# Altium project Current-Probe.PrjPcb
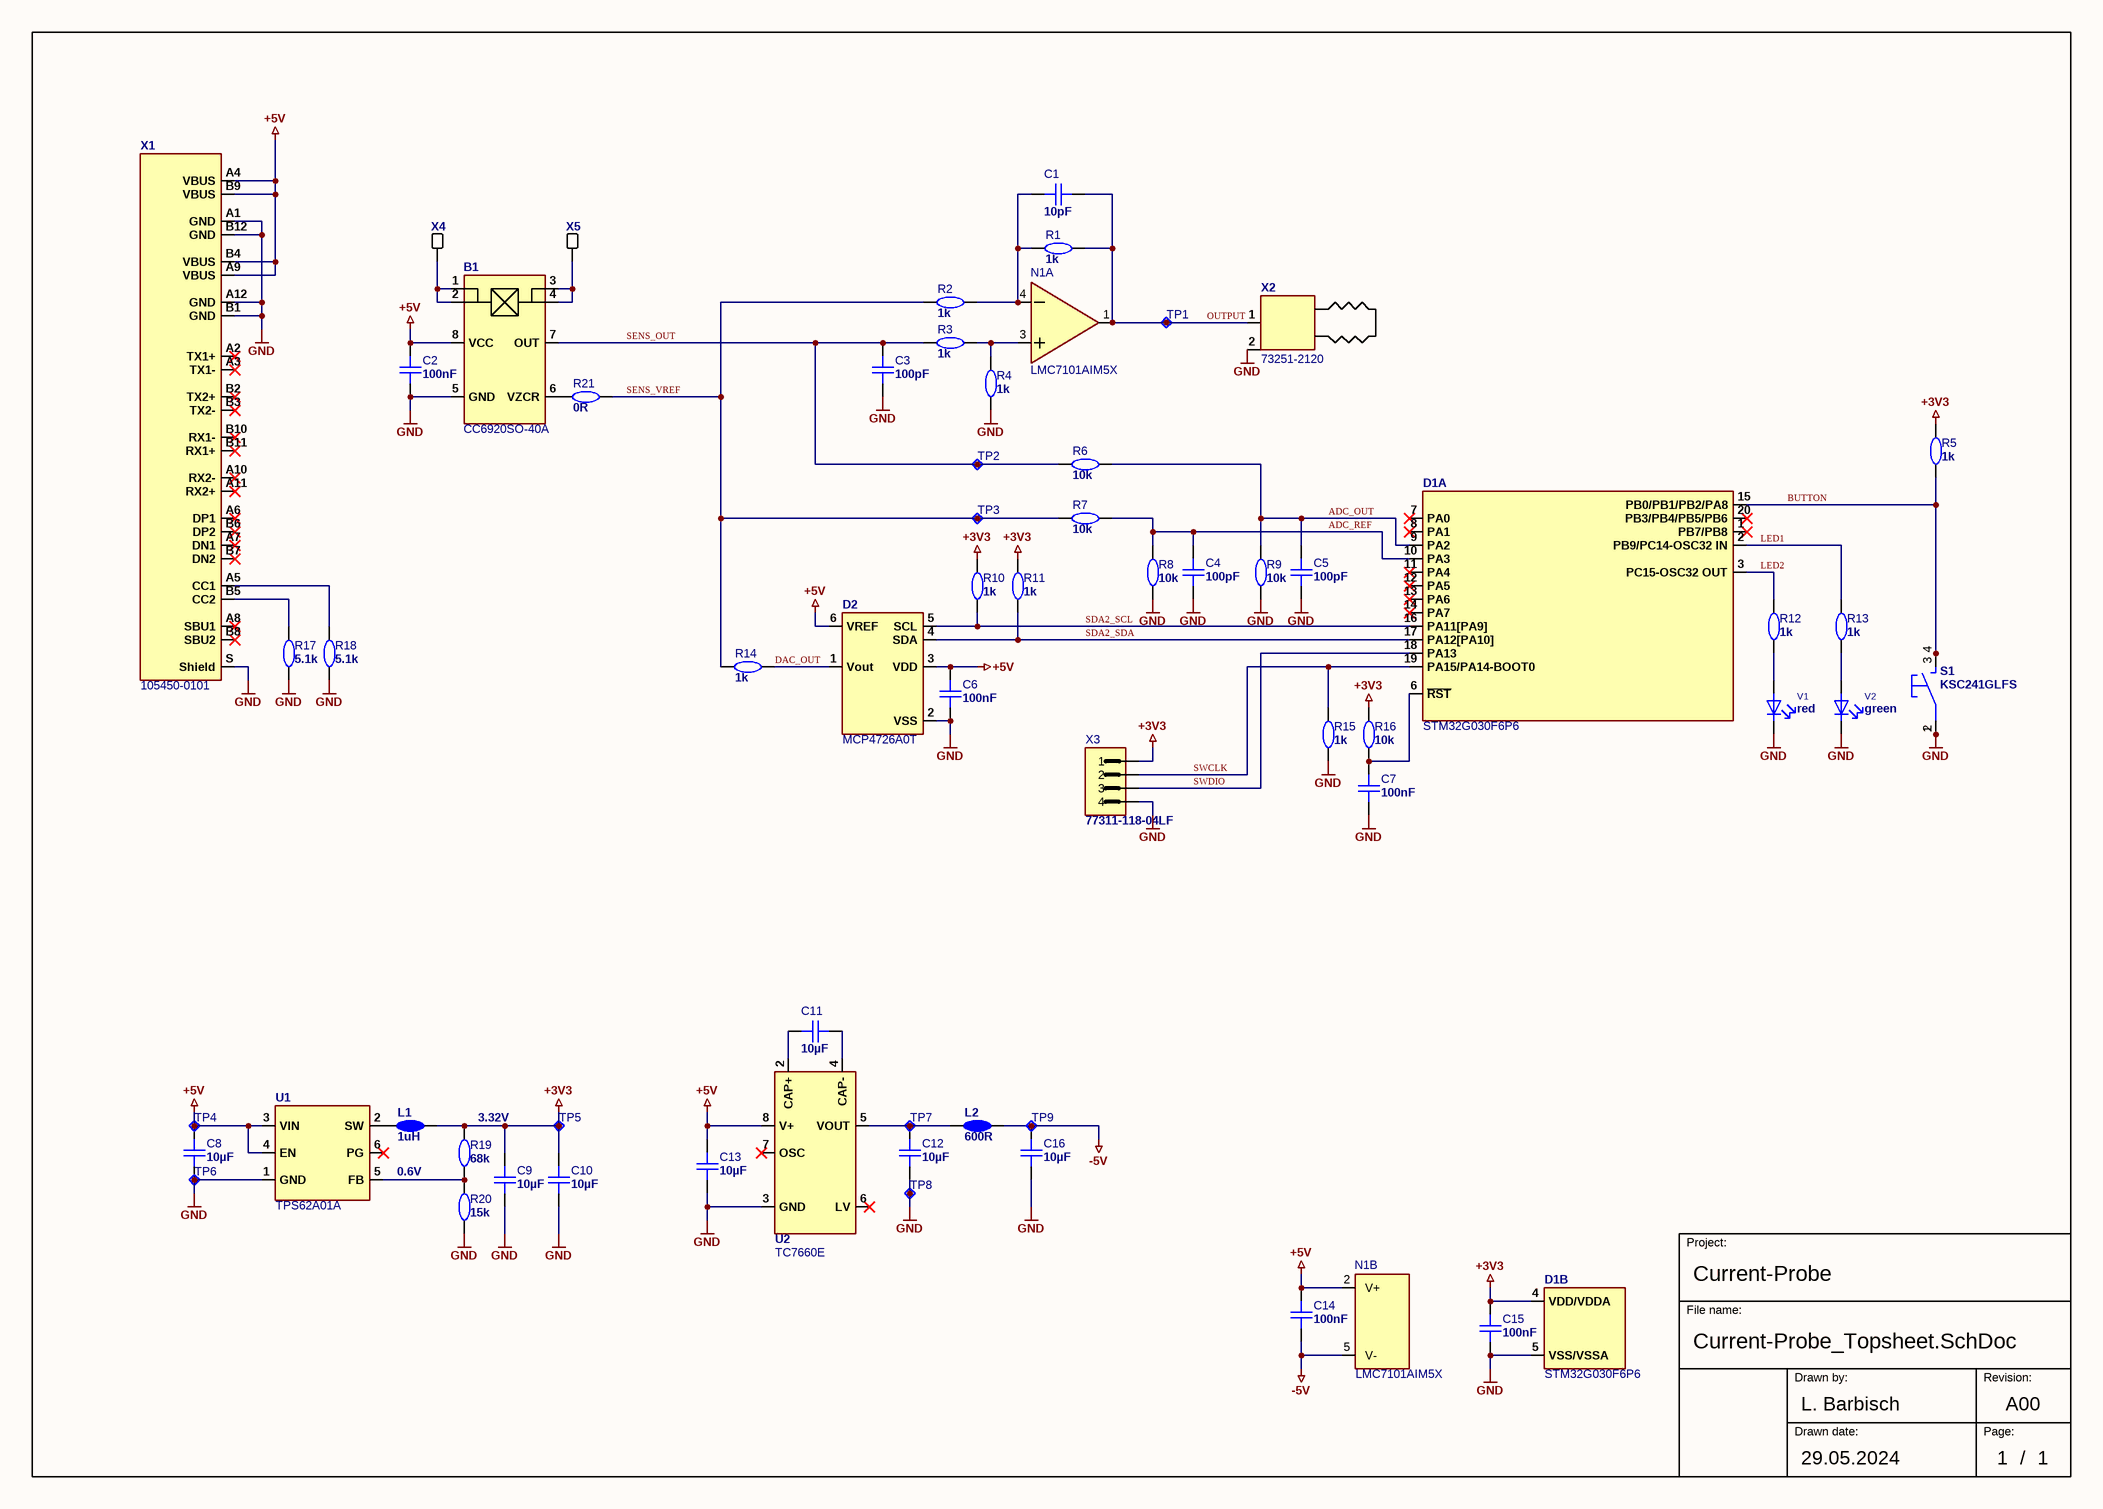
[diagram p0: Current-Probe_Topsheet.SchDoc]
Schematic_Title: Current-Probe; Schematic_Revision: A00; Schematic_DrawnDate: 29.05.2024; Schematic_DrawnBy: L. Barbisch; Schematic_DocumentNo: XXXXXXXX; Schematic_CheckedDate: dd.mm.yyyy; Schematic_CheckedBy: C. Sch Checker; Revision: A00; Project: Current-Probe; PCB_TP_Revision: A; PCB_TP_DocumentNo: XXXXXXXX; PCB_Title: Current-Probe; PCB_Revision: A; PCB_PartNo: XXX.XXXX; PCB_DrawnDate: 07.06.2024; PCB_DrawnBy: L. Barbisch; PCB_CheckedDate: dd.mm.yyyy; PCB_CheckedBy: C. PCB Checker; PCB_Assy_DrawnDate: dd.mm.yyyy; PCB_Assy_DrawnBy: A. P. Assy
1 sheet, 62 parts. Net scope: global (net labels, ports and power ports of the same name join across sheets).
Board file: Current-Probe.PcbDoc

## Sheet Current-Probe_Topsheet.SchDoc
size A3; SheetNumber: 1; SheetTotal: 1

### Parts
B1  CC6920SO-40A  [SOIC8_N_RF]
C1  value 10pF  [C-0603_1608_095_L_RF]  (hidden comment: Cap 10p 0603)
C2  value 100nF  [C-0603_1608_095_L_RF]  (hidden comment: Cap 100n 0603)
C3  value 100pF  [C-0603_1608_095_L_RF]  (hidden comment: Cap 100p 0603)
C4  value 100pF  [C-0603_1608_095_L_RF]  (hidden comment: Cap 100p 0603)
C5  value 100pF  [C-0603_1608_095_L_RF]  (hidden comment: Cap 100p 0603)
C6  value 100nF  [C-0603_1608_095_L_RF]  (hidden comment: Cap 100n 0603)
C7  value 100nF  [C-0603_1608_095_L_RF]  (hidden comment: Cap 100n 0603)
C8  value 10µF  [C-0805_2012_155_L_RF]  (hidden comment: Cap 10u 0805)
C9  value 10µF  [C-0805_2012_155_L_RF]  (hidden comment: Cap 10u 0805)
C10  value 10µF  [C-0805_2012_155_L_RF]  (hidden comment: Cap 10u 0805)
C11  value 10µF  [C-0805_2012_155_L_RF]  (hidden comment: Cap 10u 0805)
C12  value 10µF  [C-0805_2012_155_L_RF]  (hidden comment: Cap 10u 0805)
C13  value 10µF  [C-0805_2012_155_L_RF]  (hidden comment: Cap 10u 0805)
C14  value 100nF  [C-0603_1608_095_L_RF]  (hidden comment: Cap 100n 0603)
C15  value 100nF  [C-0603_1608_095_L_RF]  (hidden comment: Cap 100n 0603)
C16  value 10µF  [C-0805_2012_155_L_RF]  (hidden comment: Cap 10u 0805)
D1  STM32G030F6P6  [TSSOP20_N_RF]  (parts A,B of 2)
D2  MCP4726A0T  [SOT23-6_N_RF]
L1  1uH  [L_0805_N_RF]
L2  600R  [L_0805_N_RF]
N1  LMC7101AIM5X  [SOT23-5_L_RF]  (parts A,B of 2)
R1  value 1k  [R-0603_1608_050_L_RF]  (hidden comment: Res 1k 0603)
R2  value 1k  [R-0603_1608_050_L_RF]  (hidden comment: Res 1k 0603)
R3  value 1k  [R-0603_1608_050_L_RF]  (hidden comment: Res 1k 0603)
R4  value 1k  [R-0603_1608_050_L_RF]  (hidden comment: Res 1k 0603)
R5  value 1k  [R-0603_1608_050_L_RF]  (hidden comment: Res 1k 0603)
R6  value 10k  [R-0603_1608_050_L_RF]  (hidden comment: Res 10k 0603)
R7  value 10k  [R-0603_1608_050_L_RF]  (hidden comment: Res 10k 0603)
R8  value 10k  [R-0603_1608_050_L_RF]  (hidden comment: Res 10k 0603)
R9  value 10k  [R-0603_1608_050_L_RF]  (hidden comment: Res 10k 0603)
R10  value 1k  [R-0603_1608_050_L_RF]  (hidden comment: Res 1k 0603)
R11  value 1k  [R-0603_1608_050_L_RF]  (hidden comment: Res 1k 0603)
R12  value 1k  [R-0603_1608_050_L_RF]  (hidden comment: Res 1k 0603)
R13  value 1k  [R-0603_1608_050_L_RF]  (hidden comment: Res 1k 0603)
R14  value 1k  [R-0603_1608_050_L_RF]  (hidden comment: Res 1k 0603)
R15  value 1k  [R-0603_1608_050_L_RF]  (hidden comment: Res 1k 0603)
R16  value 10k  [R-0603_1608_050_L_RF]  (hidden comment: Res 10k 0603)
R17  value 5.1k  [R-0603_1608_050_L_RF]  (hidden comment: Res 5k1 0603)
R18  value 5.1k  [R-0603_1608_050_L_RF]  (hidden comment: Res 5k1 0603)
R19  value 68k  [R-0603_1608_050_L_RF]  (hidden comment: Res 68k 0603)
R20  value 15k  [R-0603_1608_050_L_RF]  (hidden comment: Res 15k 0603)
R21  value 0R  [R-0603_1608_050_L_RF]  (hidden comment: Res 0R 0603)
S1  KSC241GLFS  [S-0062x0062_R_P0890_C&K-KSC-241G-LFS]
TP1  TestPoint 1.0mm  [TP_1.0mm]  (value not drawn)  (no BOM)
TP2  TestPoint 1.0mm  [TP_1.0mm]  (value not drawn)  (no BOM)
TP3  TestPoint 1.0mm  [TP_1.0mm]  (value not drawn)  (no BOM)
TP4  TestPoint 1.0mm  [TP_1.0mm]  (value not drawn)  (no BOM)
TP5  TestPoint 1.0mm  [TP_1.0mm]  (value not drawn)  (no BOM)
TP6  TestPoint 1.0mm  [TP_1.0mm]  (value not drawn)  (no BOM)
TP7  TestPoint 1.0mm  [TP_1.0mm]  (value not drawn)  (no BOM)
TP8  TestPoint 1.0mm  [TP_1.0mm]  (value not drawn)  (no BOM)
TP9  TestPoint 1.0mm  [TP_1.0mm]  (value not drawn)  (no BOM)
U1  TPS62A01A  [SOT-563_N_RF]
U2  TC7660E  [SOIC8_N_RF]
V1  value red  [LED-0603_1608_Red_L_RF]  (hidden comment: LED SMD 0603 Red)
V2  value green  [LED-0603_1608_Green_L_RF]  (hidden comment: LED SMD 0603 Green)
X1  105450-0101  [105450-0101]
X2  73251-2120  [73251-2120]
X3  value 77311-118-04LF  [X-0101X0025_R_FCI_77311-118-04LF]  (hidden comment: CONN HEADER 4POS 1ROW THT 2.54MM)
X4  (no value)  [Lötpad_2x3]  (no BOM)
X5  (no value)  [Lötpad_2x3]  (no BOM)

### Nets
+3V3: C9.2 C10.2 C15.2 D1.4(VDD/VDDA) L1.2 R5.2 R10.2 R11.2 R16.2 R19.2 TP5.1 X3.1
+5V: B1.8(VCC) C2.2 C6.2 C8.2 C13.2 C14.2 D2.3(VDD) D2.6(VREF) N1.2(V+) TP4.1 U1.3(VIN) U1.4(EN) U2.8(V+) X1.A4(VBUS) X1.A9(VBUS) X1.B4(VBUS) X1.B9(VBUS)
-5V: C14.1 C16.2 L2.2 N1.5(V-) TP9.1
GND: B1.5(GND) C2.1 C3.1 C4.1 C5.1 C6.1 C7.1 C8.1 C9.1 C10.1 C12.1 C13.1 C15.1 C16.1 D1.5(VSS/VSSA) D2.2(VSS) R4.2 R8.1 R9.1 R15.1 R17.1 R18.1 R20.1 S1.1 S1.2 TP6.1 TP8.1 U1.1(GND) U2.3(GND) V1.2 V2.2 X1.A1(GND) X1.A12(GND) X1.B1(GND) X1.B12(GND) X1.S(Shield) X2.2 X3.4
ADC_OUT: C5.2 D1.9(PA2) R6.2 R9.2
ADC_REF: C4.2 D1.10(PA3) R7.2 R8.2
BUTTON: D1.15(PB0/PB1/PB2/PA8) R5.1 S1.3 S1.4
DAC_OUT: D2.1(Vout) R14.2
LED1: D1.2(PB9/PC14-OSC32_IN) R13.2
LED2: D1.3(PC15-OSC32_OUT) R12.2
OUTPUT: C1.2 N1.1 R1.2 TP1.1 X2.1
SDA2_SCL: D1.16(PA11[PA9]) D2.5(SCL) R10.1
SDA2_SDA: D1.17(PA12[PA10]) D2.4(SDA) R11.1
SENS_OUT: B1.7(OUT) C3.2 R3.1 R6.1 TP2.1
SENS_VREF: R2.1 R7.1 R14.1 R21.2 TP3.1
SWCLK: D1.19(PA15/PA14-BOOT0) R15.2 X3.2
SWDIO: D1.18(PA13) X3.3
NetB1_1: B1.1(IP+) B1.2(IP+) X4.1
NetB1_3: B1.3(IP-) B1.4(IP-) X5.1
NetB1_6: B1.6(VZCR) R21.1
NetC1_1: C1.1 N1.4 R1.1 R2.2
NetC7_2: C7.2 D1.6(~{RST}) R16.1
NetC11_1: C11.1 U2.4(CAP-)
NetC11_2: C11.2 U2.2(CAP+)
NetC12_2: C12.2 L2.1 TP7.1 U2.5(VOUT)
NetL1_1: L1.1 U1.2(SW)
NetN1_3: N1.3 R3.2 R4.1
NetR12_1: R12.1 V1.1
NetR13_1: R13.1 V2.1
NetR17_2: R17.2 X1.B5(CC2)
NetR18_2: R18.2 X1.A5(CC1)
NetR19_1: R19.1 R20.2 U1.5(FB)

Not connected (* = marked no-connect by the designer): D1 1(PB7/PB8)* 7(PA0)* 8(PA1)* 11(PA4)* 12(PA5)* 13(PA6)* 14(PA7)* 20(PB3/PB4/PB5/PB6)*; U1 6(PG)*; U2 6(LV)* 7(OSC)*; X1 A2(TX1+)* A3(TX1-)* A6(DP1)* A7(DN1)* A8(SBU1)* A10(RX2-)* A11(RX2+)* B2(TX2+)* B3(TX2-)* B6(DP2)* B7(DN2)* B8(SBU2)* B10(RX1-)* B11(RX1+)*

### Notes on the sheet
- (near R19) 3.32V
- 0.6V
- Project:
- File name:
- Drawn by:
- Revision:
- Drawn date:
- Page:
- /

### Library data of the parts
B1 = CC6920SO-40A: IC Current sensor ±40A 5V; Part_validated: No; Manufacturer: Cross chip; GPV_Number: xxxx.xxxx; MNL_Number: xxxxxxxx; Value: CC6920SO-40A; Footprint_validated: No; PartStatus: New; System: -; ClassName: Surface_Assy; Case/Package: SO8; Technology: SMT; Manufacturer Part Number: CC6920SO-40A
C1 = CMP-001-0041-2: Cap Cer SMD 10p 50V +/- 0.25pF  0603 C0G; Manufacturer Part Number: 06035A100CAT*; Manufacturer: AVX; Prefered: true; GPV_Number: 1749.0090; User: zupa; Case / Package: 0603; ComponentLink1Description: Datasheet; ClassName: Surface_Assy; PartStatus: Release; Technology: SMT; ComponentLink1URL: https://datasheet.ciiva.com/11464/ccog-11464569.pdf
C2 C6 C7 C14 C15 = CMP-001-0037-3: Cap Cer SMD 100n 50V 10% 0603 X7R; Manufacturer: KEMET; Manufacturer Part Number: C0603C104K5RAC; User: epph; Prefered: true; MNL_Number: 22310507; GPV_Number: 1749.0075; Case / Package: 0603; PartStatus: Release; Technology: SMT; ClassName: Surface_Assy
C3-C5 = CMP-001-0000-2: Cap Cer SMD 100p 50V 5% 0603 C0G; Manufacturer Part Number: CC0603J*NPO9BN101; Manufacturer: YAGEO; User: zupa; GPV_Number: 1749.0055; Prefered: false; Technology: SMT; PartStatus: Release; Case / Package: 0603; ComponentLink1Description: Datasheet; ComponentLink1URL: https://datasheet.ciiva.com/11786/0900766b8079c870-11786060.pdf; ClassName: Surface_Assy
C8-C13 C16 = CMP-00147-1: Cap Cer SMD 10u 16V 10% 0805 X7R; Manufacturer: Yageo; Manufacturer Part Number: CC0805KKX7R7BB106; Prefered: true; User: epph; GPV_Number: 1750.0364; Technology: SMT; Manufacturer Part Number 2: CL21B106KOQNNN; ClassName: Surface_Assy; Case / Package: 0805; Manufacturer 2: SAMSUNG; PartStatus: Release
D1 = STM32G030F6P6: IC MCU Cortex M0+ 32K Flash, 8K RAM, 64MHz; Part_validated: No; Manufacturer: ST; GPV_Number: xxxx.xxxx; MNL_Number: xxxxxxxx; Value: STM32G030F6P6; Footprint_validated: No; PartStatus: New; System: -; ClassName: Surface_Assy; Case/Package: TSSOP20; Technology: SMT; Manufacturer Part Number: STM32G030F6P6; Supplier 1: Arrow Electronics; Supplier Part Number 1: STM32G030F6P6TR
D2 = MCP4726A0T: IC DAC I2C 12Bit 2.7V-5.5V; Part_validated: No; Manufacturer: Microchip; GPV_Number: xxxx.xxxx; MNL_Number: xxxxxxxx; Value: MCP4726A0T; Footprint_validated: No; PartStatus: New; System: -; ClassName: Surface_Assy; Case/Package: SOT-23-6; Technology: SMT; Manufacturer Part Number: MCP4726A0T
L1 = MPH201210S1R0: Inductor 1uH 0.95A; Part_validated: No; Manufacturer: Sunlord; GPV_Number: xxxx.xxxx; MNL_Number: xxxxxxxx; Value: 1uH; Footprint_validated: No; PartStatus: New; System: -; ClassName: Surface_Assy; Case/Package: 0805; Technology: SMT; Manufacturer Part Number: MPH201210S1R0
L2 = 782853611: Ferrite Bead 600Ohm 2A 0805; Part_validated: Yes | No; Manufacturer: Würth; GPV_Number: xxxx.xxxx; System: Connector; MNL_Number: xxxxxxxx; Footprint_validated: Yes | No; PartStatus: New | Draft | Release; ClassName: Surface_Assy | Testpoint | Through-Hole_Assy | NetTie | Symbol | Mechanical; Case/Package: 0201 | 0402 | 0603 | 0805 | 1206 | SO8 | SO16 |; Technology: SMT | THT | SMT-BTC; Manufacturer Part Number: 782853611; Value: 600R
N1 = CMP-001-1191-2: Low Power OP Rail to Rail; Manufacturer: Texas Instrument; Value: LM78L12ACM; User: zupa; GPV_Number: 1500.1871; Technology: SMT; ClassName: Surface_Assy; Case / Package: SOT23-5; Manufacturer Part Number: LMC7101AIM5X; PartStatus: Release
R1-R5 R10-R15 = CMP-001-0250-3: Res SMD 1k 1% 0.1W 0603; Manufacturer: YAGEO; Manufacturer Part Number: RC0603FR-071KL; MNL_Number: 15310012; User: zupa; GPV_Number: 1922.0011; Prefered: true; Technology: SMT; ComponentLink1Description: Datasheet; ClassName: Surface_Assy; ComponentLink1URL: https://datasheet.ciiva.com/11808/0900766b80f96399-11808280.pdf; Case / Package: 0603; PartStatus: Release
R6-R9 R16 = CMP-001-0241-3: Res SMD 10k 1% 0.1W 0603; Manufacturer: YAGEO; Manufacturer Part Number: RC0603FR-0710KL; MNL_Number: 15310022; GPV_Number: 1922.0100; User: zupa; Prefered: true; Case / Package: 0603; ClassName: Surface_Assy; PartStatus: Release; ComponentLink1URL: https://datasheet.ciiva.com/11808/0900766b80f96399-11808280.pdf; ComponentLink1Description: Datasheet; Technology: SMT
R17 R18 = CMP-001-0582-3: Res SMD 5k1 1% 0.1W 0603; Manufacturer Part Number: RC0603FR-075K1L; Manufacturer: YAGEO; Prefered: true; GPV_Number: 1922.0144; User: napa; Technology: SMT; ComponentLink1URL: https://datasheet.ciiva.com/8895/pyu-rc0603-51-rohs-l-4-8895189.pdf; PartStatus: Release; ClassName: Surface_Assy; ComponentLink1Description: Datasheet; Case / Package: 0603
R19 = CMP-001-0280-3: Res SMD 68k 1% 0.1W 0603; Manufacturer Part Number: RC0603FR-0768KL; Manufacturer: YAGEO; GPV_Number: 1922.1473; User: zupa; Prefered: true; ClassName: Surface_Assy; PartStatus: Release; ComponentLink1URL: https://datasheet.ciiva.com/11808/0900766b80f96399-11808280.pdf; ComponentLink1Description: Datasheet; Case / Package: 0603; Technology: SMT
R20 = CMP-001-0247-3: Res SMD 15k 1% 0.1W 0603; Manufacturer: YAGEO; Manufacturer Part Number: RC0603FR-0715KL; GPV_Number: 1922.0034; Prefered: true; User: zupa; PartStatus: Release; ComponentLink1URL: https://datasheet.ciiva.com/11808/0900766b80f96399-11808280.pdf; ComponentLink1Description: Datasheet; Technology: SMT; Case / Package: 0603; ClassName: Surface_Assy
R21 = CMP-001-0239-3: Res SMD 0R 0.1W 0603; Manufacturer Part Number: RK73Z1JT**; Manufacturer: KOA; User: zupa; MNL_Number: 15500007; GPV_Number: 1922.1618; Prefered: false; ClassName: Surface_Assy; Technology: SMT; ComponentLink1Description: Datasheet; PartStatus: Release; ComponentLink1URL: https://datasheet.ciiva.com/26914/getdatasheetpartid-123499-26914653.pdf
S1 = CMP-00014-2: Switch Tactile N.O. SPST Round Button Gull Wing 0.05A 32VDC 1VA 300000Cycle 4N SMD T/R; Manufacturer: ITT C&K; Part_validated: False; GPV_Number: 2820.0686; System: Connector; MNL_Number: xxxxxxxx; Design Item ID: KSC241GLFS; ComponentLink4Description: https://datasheet.ciiva.com/2900/ksc-2900212.pdf?src-supplier=Digi-Key; ComponentLink3URL: https://datasheet.ciiva.com/2900/ksc-2900211.pdf?src-supplier=Digi-Key; ComponentLink7Description: https://datasheet.ciiva.com/2900/ksc-2900210.pdf?src-supplier=Digi-Key; ComponentLink3Description: https://datasheet.ciiva.com/2900/ksc-2900211.pdf?src-supplier=Digi-Key; ComponentLink1Description: https://datasheet.ciiva.com/22637/1707722-22637312.pdf?src-supplier=Element14; ComponentLink6URL: https://datasheet.ciiva.com/16369/ksc241glfs-16369405.pdf?src-supplier=Future+Electronics; ClassName: Surface_Assy; ComponentLink4URL: https://datasheet.ciiva.com/2900/ksc-2900212.pdf?src-supplier=Digi-Key; ComponentLink1URL: https://datasheet.ciiva.com/22637/1707722-22637312.pdf?src-supplier=Element14; Value: KSC241GLFS; ComponentLink6Description: https://datasheet.ciiva.com/16369/ksc241glfs-16369405.pdf?src-supplier=Future+Electronics; ComponentLink2URL: https://datasheet.ciiva.com/26827/ksc-22jan15-26827234.pdf?src-supplier=Verical; ComponentLink5Description: https://datasheet.ciiva.com/7987/320569-7987015.pdf?src-supplier=Element14; ComponentLink5URL: https://datasheet.ciiva.com/7987/320569-7987015.pdf?src-supplier=Element14; PartStatus: New; Manufacturer Part Number: KSC241GLFS; Source: Tischstation_BWE_Part_Prj.SchLib; Footprint_validated: False; ComponentLink2Description: https://datasheet.ciiva.com/26827/ksc-22jan15-26827234.pdf?src-supplier=Verical; ComponentLink7URL: https://datasheet.ciiva.com/2900/ksc-2900210.pdf?src-supplier=Digi-Key
TP1-TP9 = CMP-001-1516-3: Value: TP; User: zupa; PartStatus: Release; ClassName: Testpoint; Technology: SMT; GPV_Number: -
U1 = TPS62A01A: IC BUCK 1A 2.5-5.5Vin 2.4MHz; Manufacturer: TI; Manufacturer Part Number: TPS62A01ADRLR; CPN: 10018707-E; LPN: 1291853; Value: TPS62A01A; System: -; ClassName: Surface_Assy; Case/Package: SOT563; Technology: SMT; Supplier 1: Mouser; Supplier Part Number 1: 595-TPS62A01ADRLR
U2 = TC7660E: IC REG Charge Pump negative; Part_validated: No; Manufacturer: Microchip; GPV_Number: xxxx.xxxx; MNL_Number: xxxxxxxx; Value: TC7660E; Footprint_validated: No; PartStatus: New; System: -; ClassName: Surface_Assy; Case/Package: SO8; Technology: SMT; Manufacturer Part Number: TC7660E; Supplier 1: Onlinecomponents.com; Supplier Part Number 1: TC7660EOA
V1 = CMP-00078-2: LED Red LTST-C190KRKT 0603; Manufacturer: Lite-On Inc; User: epph; GPV_Number: 1602.0646; Technology: SMT; Manufacturer Part Number: LTST-C190KRKT; ClassName: Surface_Assy; Case / Package: 0603; PartStatus: Release
V2 = CMP-001-1208-7: LED Green LTST-C190KGKT 0603; Manufacturer: Lite-On Inc; User: epph; GPV_Number: 1602.0827; Case / Package: 0603; PartStatus: Release; Technology: SMT; ClassName: Surface_Assy; Manufacturer Part Number: LTST-C190KGKT
X1 = 105450-0101: CONN USB-C 16pin; Part_validated: No; Manufacturer: Molex; GPV_Number: xxxx.xxxx; System: Connector; MNL_Number: xxxxxxxx; Value: 105450-0101; Footprint_validated: No; PartStatus: New; ClassName: Through-Hole_Assy; Case/Package: USB-C; Technology: SMT; Manufacturer Part Number: 105450-0101
X2 = 73251-2120: CONN RF SMA; Part_validated: No; Manufacturer: MOLEX; GPV_Number: xxxx.xxxx; System: Connector; MNL_Number: xxxxxxxx; Value: 73251-2120; Footprint_validated: No; PartStatus: New; ClassName: Through-Hole_Assy; Case/Package: SMA; Technology: THT; Manufacturer Part Number: 73251-2120
X3 = CMP-001-1284-4: CONN HEADER 4POS 1ROW THT 2.54MM FCI 77311-118-04LF; System: Connector; GPV_Number: 4401.2630; User: zupa; Manufacturer: FCI; Technology: THT; PartStatus: Release; ClassName: Through-Hole_Assy; Manufacturer Part Number: 77311-118-04LF; ComponentLink1URL: http://portal.fciconnect.com/Comergent//fci/drawing/77311.pdf; ComponentLink1Description: Datasheet
X4 X5 = Lötpad_2mmx3mm: Solderpad 2mm x 3mm; Part_validated: No; GPV_Number: xxxx.xxxx; System: Connector; MNL_Number: xxxxxxxx; Footprint_validated: No; PartStatus: New; ClassName: Testpoint; Case/Package: -; Technology: SMT; Manufacturer: -; Manufacturer Part Number: -

## Assembly variants
951.xxxx: all parts fitted